# Altium schematic sheet RELAY19.SchDoc
size A
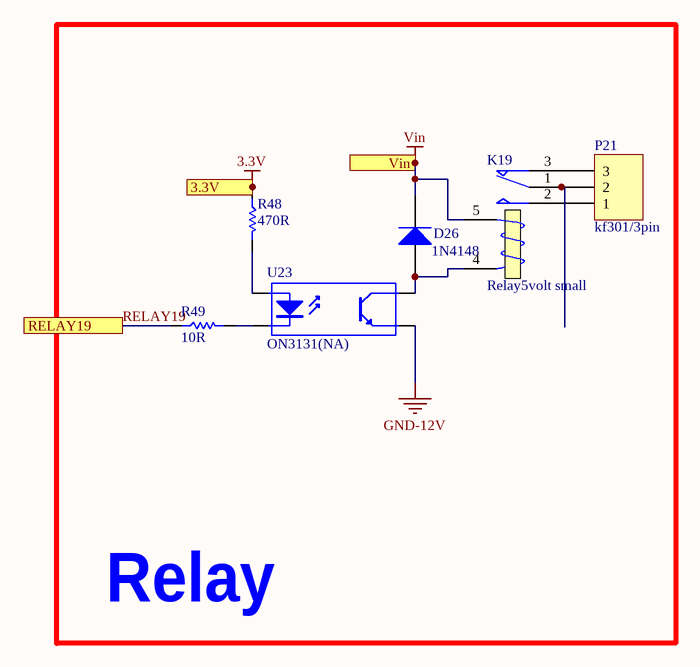
[diagram p0: RELAY19.SchDoc]

## Parts
D26  1N4148  [sod123]
K19  Relay5volt small  [relay5_childern]
P21  kf301/3pin  [Blue Connector 1*3 -kf301]
R48  470R  [0805/resistor]
R49  10R  [0805/resistor]
U23  ON3131(NA)  [OPTO_COUPLER]

## Blocks framed on the sheet
Relay: D26 K19 P21 R48 R49 U23

## Ports
3.3V, RELAY19, Vin

## Nets
3.3V: R48.1 ; port 3.3V
GND-12V: U23.3(E)
Vin: D26.K K19.5 ; port Vin
RELAY19: R49.1 ; port RELAY19
NetD26_A: D26.A K19.4(T2) U23.4(C)
NetK19_1: K19.1(COM) P21.2
NetK19_2: K19.2(NO) P21.1
NetK19_3: K19.3(T1) P21.3
NetR48_2: R48.2 U23.1(A)
NetR49_2: R49.2 U23.2(K)

## Library data of the parts
D26 = Diode 1N4007: 1 Amp General Purpose Rectifier; Published: 8-Jun-2000; LatestRevisionDate: 17-Jul-2002; LatestRevisionNote: Re-released for DXP Platform.; DatasheetVersion: 1998; PackageVersion: Aug-1999; PackageReference: DO-41; Publisher: Altium Limited; PackageDescription: Diode, Axial; Body 5.2 x 2.7 mm (LxDia. max), Lead Dia. 0.86 mm (max); Code_JEDEC: DO-204-AL; ComponentLink1Description: Manufacturer Link; ComponentLink1URL: http://www.fairchildsemi.com/; ComponentLink2Description: Datasheet; ComponentLink2URL: http://www.fairchildsemi.com/ds/1N%2F1N4001.pdf
K19 = Relay: SPDT Relay; Published: 8-Jun-2000; LatestRevisionDate: 17-Jul-2002; LatestRevisionNote: Re-released for DXP Platform.; PackageReference: MODULE5B; Publisher: Altium Limited
P21 = Header 3: LatestRevisionDate: 17-Jul-2002; LatestRevisionNote: Re-released for DXP Platform.; Publisher: Altium Limited
R48 R49 = Resistor: Tolerance: 5%; Power: 1/8 W
  R48: Value: 470R
  R49: Value: 10R
U23 = Optoisolator1: 4-Pin Phototransistor Optocoupler; Published: 24-Mar-1999; LatestRevisionDate: 04-Mar-2005; LatestRevisionNote: Sch pins 3 & 4 Swapped.; DatasheetVersion: Nov-2003; PackageReference: DIP-4; Publisher: Altium Limited